# Altium schematic sheet Power Supply.SchDoc
size A4; DocumentNumber: 8; SheetNumber: 3; SheetTotal: 9
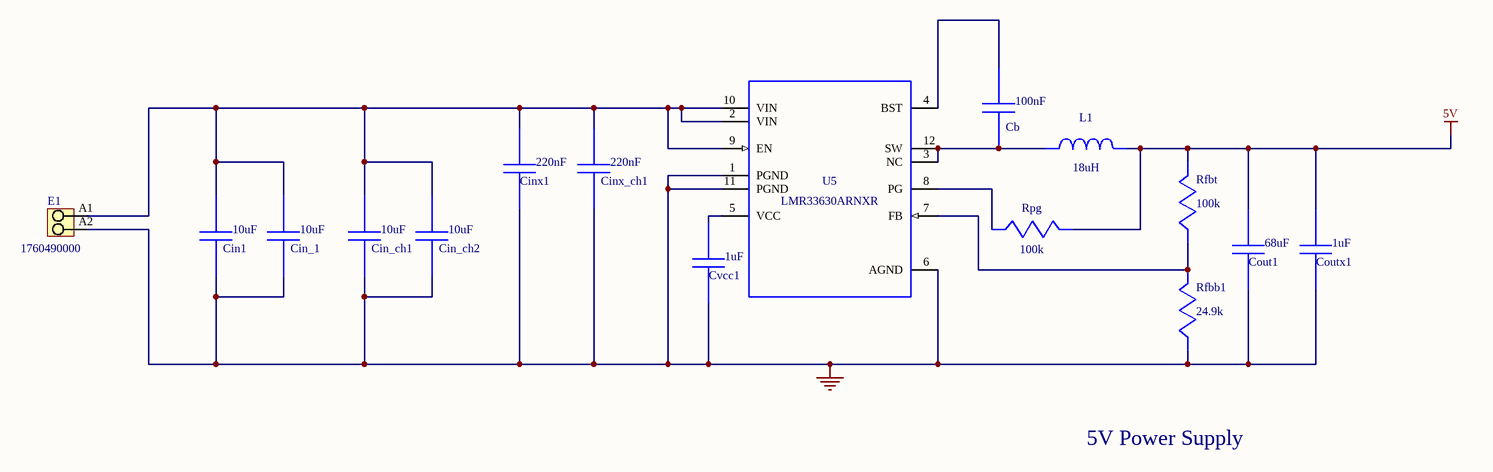
[diagram p0: Power Supply.SchDoc]

## Parts
Cb  value 100nF  [0805]  (hidden comment: CC0805KRX7R9BB104)
Cin1  value 10uF  [0805]  (hidden comment: GRM32ER71J106KA12L)
Cin_1  value 10uF  [0805]  (hidden comment: GRM32ER71J106KA12L)
Cin_ch1  value 10uF  [0805]  (hidden comment: GRM32ER71J106KA12L)
Cin_ch2  value 10uF  [0805]  (hidden comment: GRM32ER71J106KA12L)
Cinx1  value 220nF  [0603]  (hidden comment: C2012X5R1H224K125AA)
Cinx_ch1  value 220nF  [0603]  (hidden comment: C2012X5R1H224K125AA)
Cout1  value 68uF  [1210_280]  (hidden comment: C3225X5R0J686M200AC)
Coutx1  value 1uF  [0805]  (hidden comment: GRM21BR71A105KA01L)
Cvcc1  value 1uF  [0805]  (hidden comment: C0603C105Z8VACTU)
E1  1760490000  [PM_5_08_90_02]
L1  value 18uH  [CDRH125]  (hidden comment: CDRH125NP-180MC)
Rfbb1  value 24.9k  [0805]  (hidden comment: ERJ-6ENF2492V)
Rfbt  value 100k  [0805]  (hidden comment: CRCW0402100KFKED)
Rpg  value 100k  [0805]  (hidden comment: CRCW0402100KFKED)
U5  LMR33630ARNXR  [RNX0012B]

## Nets
5V: Cout1.1 Coutx1.1 L1.2 Rfbt.1 Rpg.1
GND: Cin1.2 Cin_1.2 Cin_ch1.2 Cin_ch2.2 Cinx1.2 Cinx_ch1.2 Cout1.2 Coutx1.2 Cvcc1.2 E1.A2 Rfbb1.2 U5.1(PGND) U5.6(AGND) U5.11(PGND)
NetCb_1: Cb.1 U5.4(BST)
NetCb_2: Cb.2 L1.1 U5.3(NC) U5.12(SW)
NetCin1_1: Cin1.1 Cin_1.1 Cin_ch1.1 Cin_ch2.1 Cinx1.1 Cinx_ch1.1 E1.A1 U5.2(VIN) U5.9(EN) U5.10(VIN)
NetCvcc1_1: Cvcc1.1 U5.5(VCC)
NetRfbb1_1: Rfbb1.1 Rfbt.2 U5.7(FB)
NetRpg_2: Rpg.2 U5.8(PG)

## Notes on the sheet
- 5V Power Supply

## Library data of the parts
Cb = CC0805KRX7R9BB104: CC0805KRX7R9BB10; Manufacturer Name: Yageo; PackageReference: CC0805KRX7R9BB104; Manufacturer Part Number: CC0805KRX7R9BB104
Cin1 Cin_1 Cin_ch1 Cin_ch2 = GRM32ER71J106KA12L: GRM32ER71J106KA1; Manufacturer Name: MuRata; PackageReference: GRM32ER71J106KA12L; Manufacturer Part Number: GRM32ER71J106KA12L
Cinx1 Cinx_ch1 = C2012X5R1H224K125AA: C2012X5R1H224K12; Manufacturer Name: TDK; PackageReference: C2012X5R1H224K125AA; Manufacturer Part Number: C2012X5R1H224K125AA
Cout1 = C3225X5R0J686M200AC: C3225X5R0J686M20; Manufacturer Name: TDK; PackageReference: C3225X5R0J686M200AC; Manufacturer Part Number: C3225X5R0J686M200AC
Coutx1 = GRM21BR71A105KA01L: GRM21BR71A105KA0; Manufacturer Name: MuRata; PackageReference: GRM21BR71A105KA01L; Manufacturer Part Number: GRM21BR71A105KA01L
Cvcc1 = C0603C105Z8VACTU: Manufacturer Name: Kemet; PackageReference: C0603C105Z8VACTU; Manufacturer Part Number: C0603C105Z8VACTU
E1 = CMP-1559-01627-1: OMNIMATE Signal - series PM; Manufacturer: Weidmueller; Contact_surface: tinned; Pitch_mm: 5,08 mm; Solid_min_H05_07_V_U: 0,13 mm²; Wire_cross_section_AWG_min_UL_1059: AWG 26; Wire_cross_section_AWG_max_UL_1059: AWG 14; Rated_voltage_for_surge_voltage_class_pollution_degree_II_2: 600 V; Rated_current_use_group_B_UL_1059: 15 A; Mounting_onto_the_PCB: Solder connection; Solder_pin_length_mm: 3,5 mm; Side_termination_characteristic: closed side; Contact_material: Cu-Leg; Pitch_inch: 0,2 inch; No_of_poles: 2; UL_94_flammability_rating: V-0; Insulating_material: Wemid (PA); Rated_voltage_use_group_B_UL_1059: 300 V; Solid_max_H05_07_V_U: 2,5 mm²; Short_text_for_material: PM 5.08/02/90 3.5SN OR BX; Revision: V1; PartNumber: 1760490000; Qty: 500 PCS; ComponentLink2Description: URL Link1; Packaging: Box; PackageReference: PM_5_08_90_02; ComponentLink2URL: http://catalog.weidmueller.com/catalog/Start.do?localeId=en&ObjectID=1760490000; Colour: Orange; ComponentLink1Description: Manufacturer URL; ComponentLink1URL: http://www.weidmueller.com/
L1 = CDRH125NP-180MC: Manufacturer Name: Sumida; PackageReference: CDRH125NP-180MC; Manufacturer Part Number: CDRH125NP-180MC
Rfbb1 = ERJ-6ENF2492V: Manufacturer Name: Panasonic; PackageReference: ERJ-6ENF2492V; Manufacturer Part Number: ERJ-6ENF2492V
Rfbt Rpg = CRCW0402100KFKED: Manufacturer Name: Vishay-Dale; PackageReference: CRCW0402100KFKED; Manufacturer Part Number: CRCW0402100KFKED
U5 = LMR33630ARNXR: Manufacturer Name: Texas Instruments; PackageReference: LMR33630ARNXR; Manufacturer Part Number: LMR33630ARNXR; Value: N/A